# EAGLE design me433_hw2 (EAGLE 5.12)
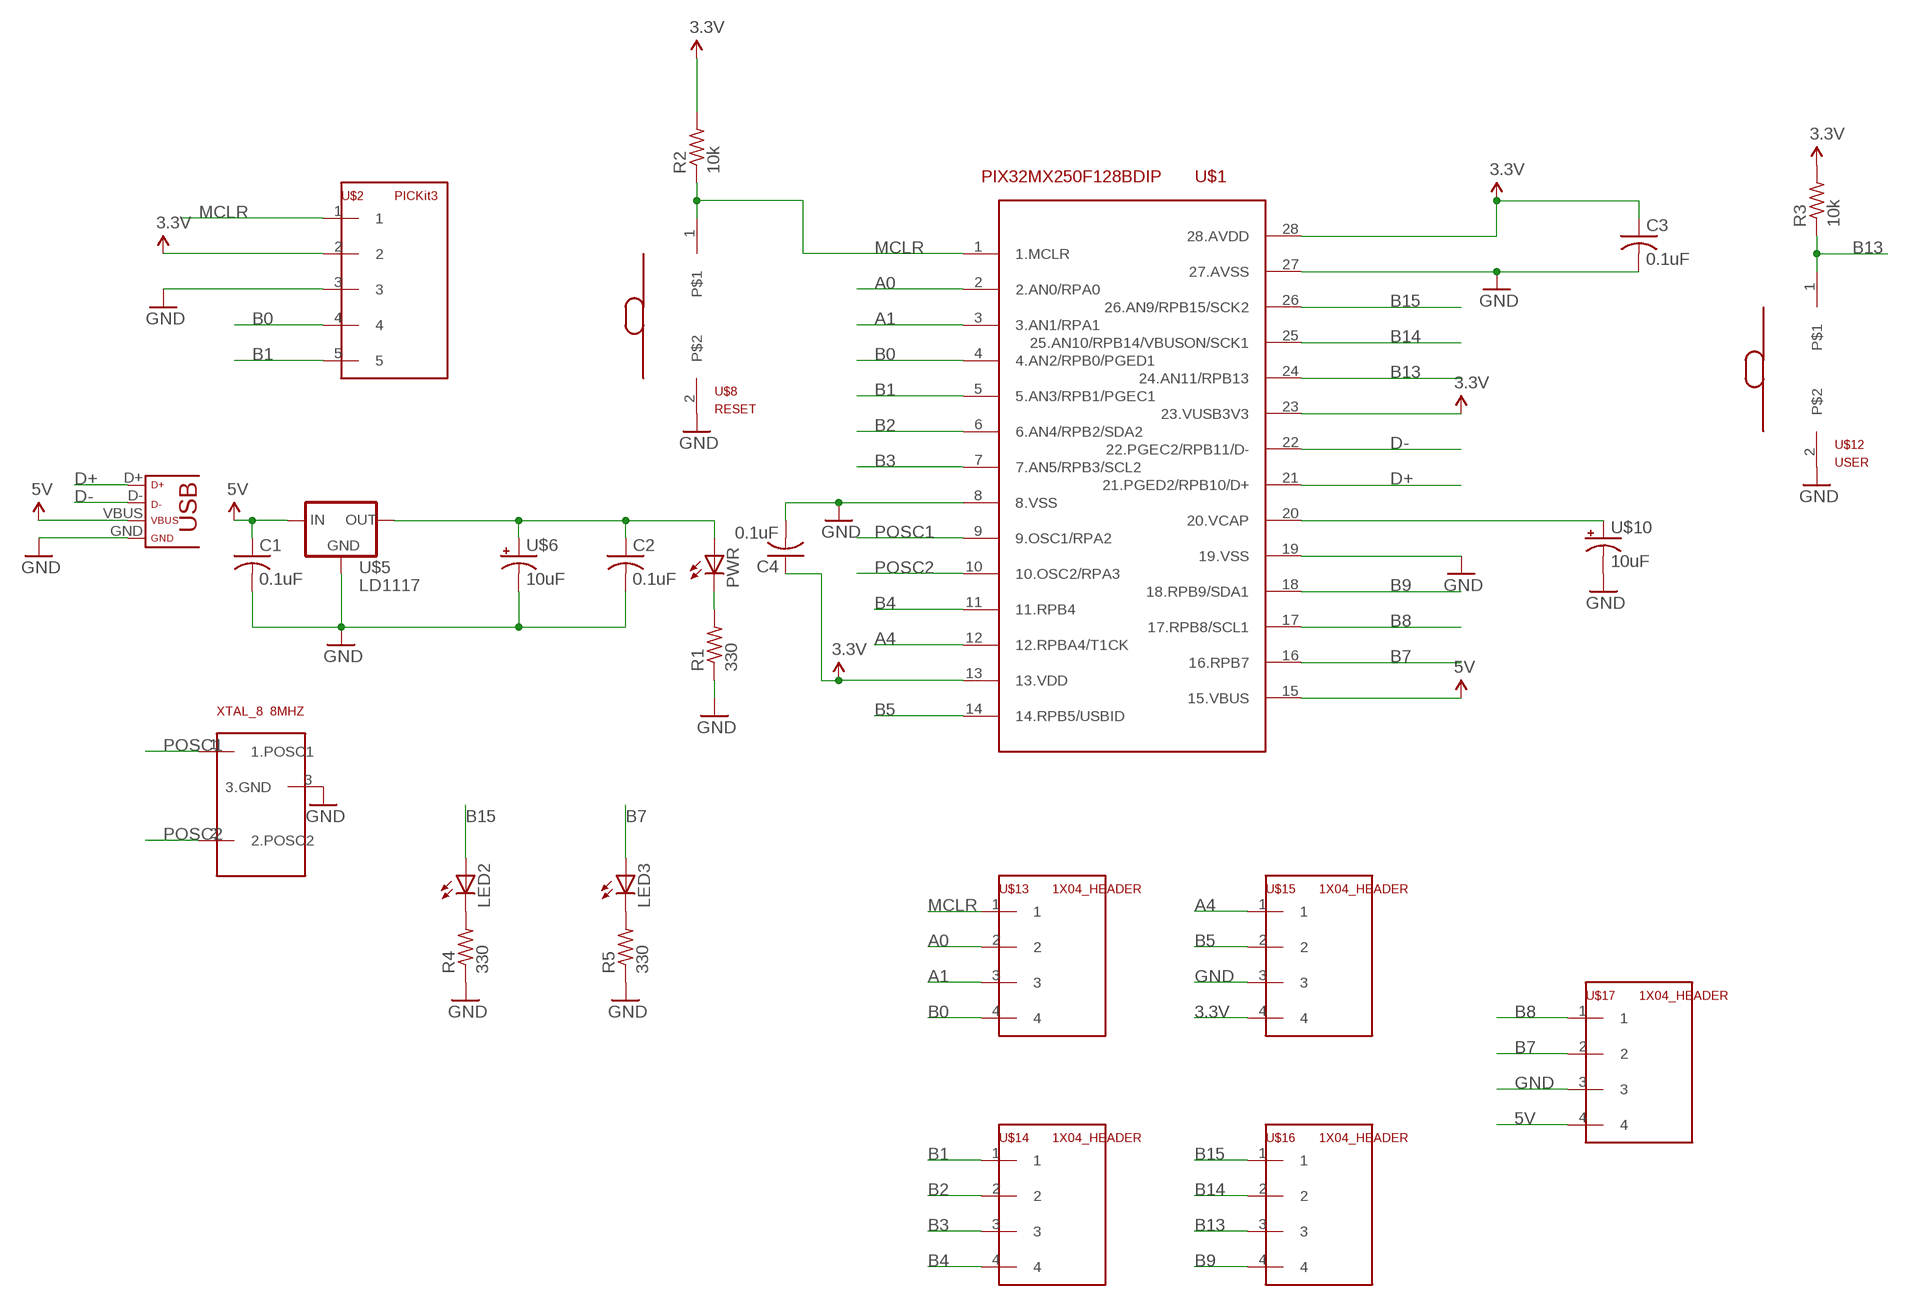
[diagram p0: schematic, sheet 1]

## Parts
8MHZ  XTAL_8  [UM4]
C1  0.1uF  C-US025-024X044  [C025-024X044]
C2  0.1uF  C-US025-024X044  [C025-024X044]
C3  0.1uF  C-US025-024X044  [C025-024X044]
C4  0.1uF  C-US025-024X044  [C025-024X044]
LED2  LED3MM  [LED3MM]
LED3  LED3MM  [LED3MM]
PWR  LED3MM  [LED3MM]
R1  330  R-US_0207/7  [0207/7]
R2  10k  R-US_0207/7  [0207/7]
R3  10k  R-US_0207/7  [0207/7]
R4  330  R-US_0207/7  [0207/7]
R5  330  R-US_0207/7  [0207/7]
U$1  PIX32MX250F128BDIP  PIC_HEADER  [PIC_HEADER]
U$2  PICKit3  1X05_HEADER  [1X05]
U$4  USB  [USB-MINIB]
U$5  LD1117  [TO220]
U$6  10uF  CAP_POL  [CAP_POL_D]
U$8  RESET  PUSH_SWITCH  [PUSH_SWITCH]
U$10  10uF  CAP_POL  [CAP_POL_D]
U$12  USER  PUSH_SWITCH  [PUSH_SWITCH]
U$13  1X04_HEADER  [1X04]
U$14  1X04_HEADER  [1X04]
U$15  1X04_HEADER  [1X04]
U$16  1X04_HEADER  [1X04]
U$17  1X04_HEADER  [1X04]

## Nets
3.3V: C3.1 C4.1 R2.2 R3.2 U$1.13(13.VDD) U$1.23(23.VUSB3V3) U$1.28(28.AVDD) U$2.2 U$15.4
5V: C1.1 U$1.15(15.VBUS) U$4.VBUS U$5.3(IN) U$17.4
A0: U$1.2(2.AN0/RPA0) U$13.2
A1: U$1.3(3.AN1/RPA1) U$13.3
A4: U$1.12(12.RPBA4/T1CK) U$15.1
B0: U$1.4(4.AN2/RPB0/PGED1) U$2.4 U$13.4
B1: U$1.5(5.AN3/RPB1/PGEC1) U$2.5 U$14.1
B2: U$1.6(6.AN4/RPB2/SDA2) U$14.2
B3: U$1.7(7.AN5/RPB3/SCL2) U$14.3
B4: U$1.11(11.RPB4) U$14.4
B5: U$1.14(14.RPB5/USBID) U$15.2
B7: LED3.A U$1.16(16.RPB7) U$17.2
B8: U$1.17(17.RPB8/SCL1) U$17.1
B9: U$1.18(18.RPB9/SDA1) U$16.4
B13: R3.1 U$1.24(24.AN11/RPB13) U$12.1 U$16.3
B14: U$1.25(25.AN10/RPB14/VBUSON/SCK1) U$16.2
B15: LED2.A U$1.26(26.AN9/RPB15/SCK2) U$16.1
D+: U$1.21(21.PGED2/RPB10/D+) U$4.D+
D-: U$1.22(22.PGEC2/RPB11/D-) U$4.D-
GND: 8MHZ.3(3.GND) C1.2 C2.2 C3.2 C4.2 R1.1 R4.1 R5.1 U$1.8(8.VSS) U$1.19(19.VSS) U$1.27(27.AVSS) U$2.3 U$4.GND U$5.1(GND) U$6.2(-) U$8.2 U$10.2(-) U$12.2 U$15.3 U$17.3
MCLR: R2.1 U$1.1(1.MCLR) U$2.1 U$8.1 U$13.1
N$1: PWR.K(C) R1.2
N$2: C2.1 PWR.A U$5.2(OUT) U$6.1(+)
N$3: LED2.K(C) R4.2
N$4: LED3.K(C) R5.2
N$16: U$1.20(20.VCAP) U$10.1(+)
POSC1: 8MHZ.1(1.POSC1) U$1.9(9.OSC1/RPA2)
POSC2: 8MHZ.2(2.POSC2) U$1.10(10.OSC2/RPA3)

## Library data of the parts
8MHZ = me422_hw2:XTAL_8
C1-C4 = me422_hw2:C-US: CAPACITOR, American symbol
LED2 LED3 PWR = me422_hw2:LED: LED OSRAM: - CHIPLED LG R971, LG N971, LY N971, LG Q971, LY Q971, LO R971, LY R971 LH N974, LH R974 LS Q976, LO Q976, LY Q976 LO Q996 - Hyper CHIPLED LW Q18S LB Q993, LB Q99A, LB R99A - SideLED LS A670, LO A670, LY A670, LG A670, LP A670 LB A673, LV A673, LT A673, LW A673 LH A674 LY A675 LS A676, LA A676, LO A676, LY A676, LW A676 LS A679, LY A679, LG A679 - Hyper Micro SIDELED® LS Y876, LA Y876, LO Y876, LY Y876 LT Y87S - SmartLED LW L88C, LW L88S LB L89C, LB L89S, LG L890 LS L89K, LO L89K, LY L89K LS L896, LA L896, LO L896, LY L896 - TOPLED LS T670, LO T670, LY T670, LG T670, LP T670 LSG T670, LSP T670, LSY T670, LOP T670, LYG T670 LG T671, LOG T671, LSG T671 LB T673, LV T673, LT T673, LW T673 LH T674 LS T676, LA T676, LO T676, LY T676, LB T676, LH T676, LSB T676, LW T676 LB T67C, LV T67C, LT T67C, LS T67K, LO T67K, LY T67K, LW E67C LS E67B, LA E67B, LO E67B, LY E67B, LB E67C, LV E67C, LT E67C LW T67C LS T679, LY T679, LG T679 LS T770, LO T770, LY T770, LG T770, LP T770 LB T773, LV T773, LT T773, LW T773 LH T774 LS E675, LA E675, LY E675, LS T675 LS T776, LA T776, LO T776, LY T776, LB T776 LHGB T686 LT T68C, LB T68C - Hyper Mini TOPLED® LB M676 - Mini TOPLED Santana® LG M470 LS M47K, LO M47K, LY M47K Source: http://www.osram.convergy.de LUXEON: - LUMILED® LXK2-PW12-R00, LXK2-PW12-S00, LXK2-PW14-U00, LXK2-PW14-V00 LXK2-PM12-R00, LXK2-PM12-S00, LXK2-PM14-U00 LXK2-PE12-Q00, LXK2-PE12-R00, LXK2-PE12-S00, LXK2-PE14-T00, LXK2-PE14-U00 LXK2-PB12-K00, LXK2-PB12-L00, LXK2-PB12-M00, LXK2-PB14-N00, LXK2-PB14-P00, LXK2-PB14-Q00 LXK2-PR12-L00, LXK2-PR12-M00, LXK2-PR14-Q00, LXK2-PR14-R00 LXK2-PD12-Q00, LXK2-PD12-R00, LXK2-PD12-S00 LXK2-PH12-R00, LXK2-PH12-S00 LXK2-PL12-P00, LXK2-PL12-Q00, LXK2-PL12-R00 Source: www.luxeon.com KINGBRIGHT: KA-3528ASYC Source: www.kingbright.com
R1-R5 = me422_hw2:R-US_: RESISTOR, American symbol
U$1 = me422_hw2:PIC_HEADER
U$2 = ME433:1X05_HEADER
U$4 = me422_hw2:USB
U$5 = me422_hw2:LD1117
U$6 U$10 = me422_hw2:CAP_POL
U$8 U$12 = me422_hw2:PUSH_SWITCH
U$13-U$17 = me422_hw2:1X04_HEADER

## Board
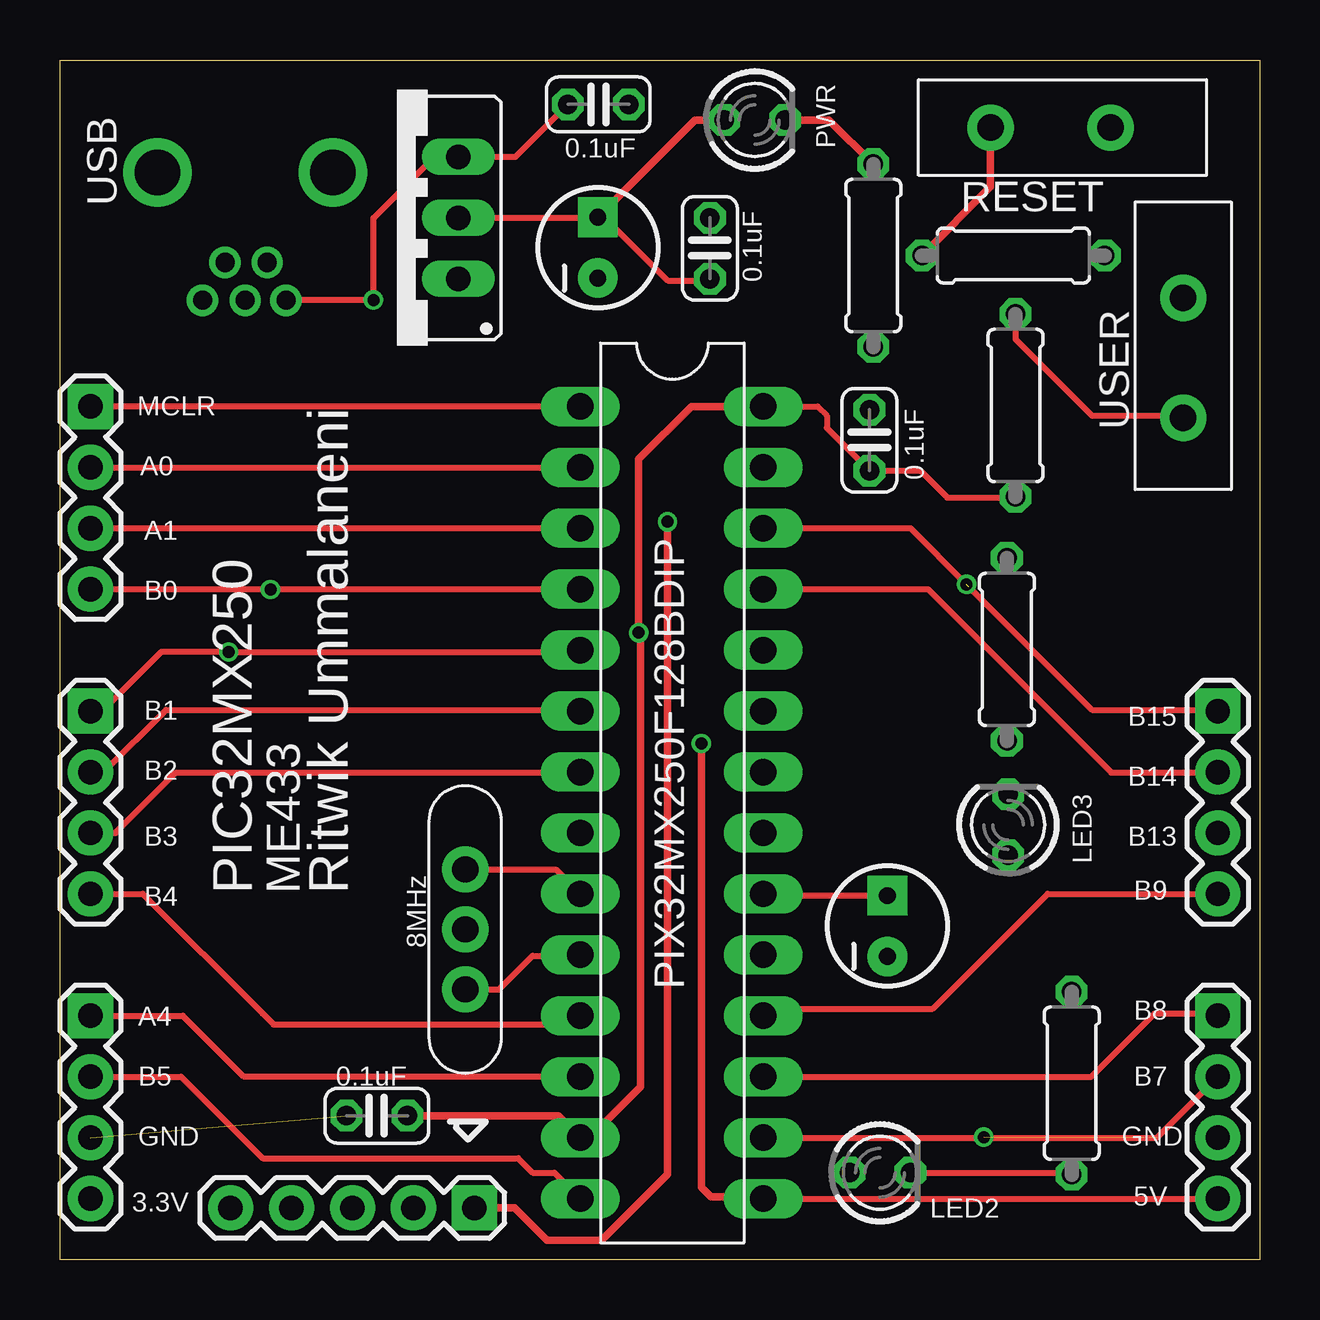
[diagram p1: board, top side]
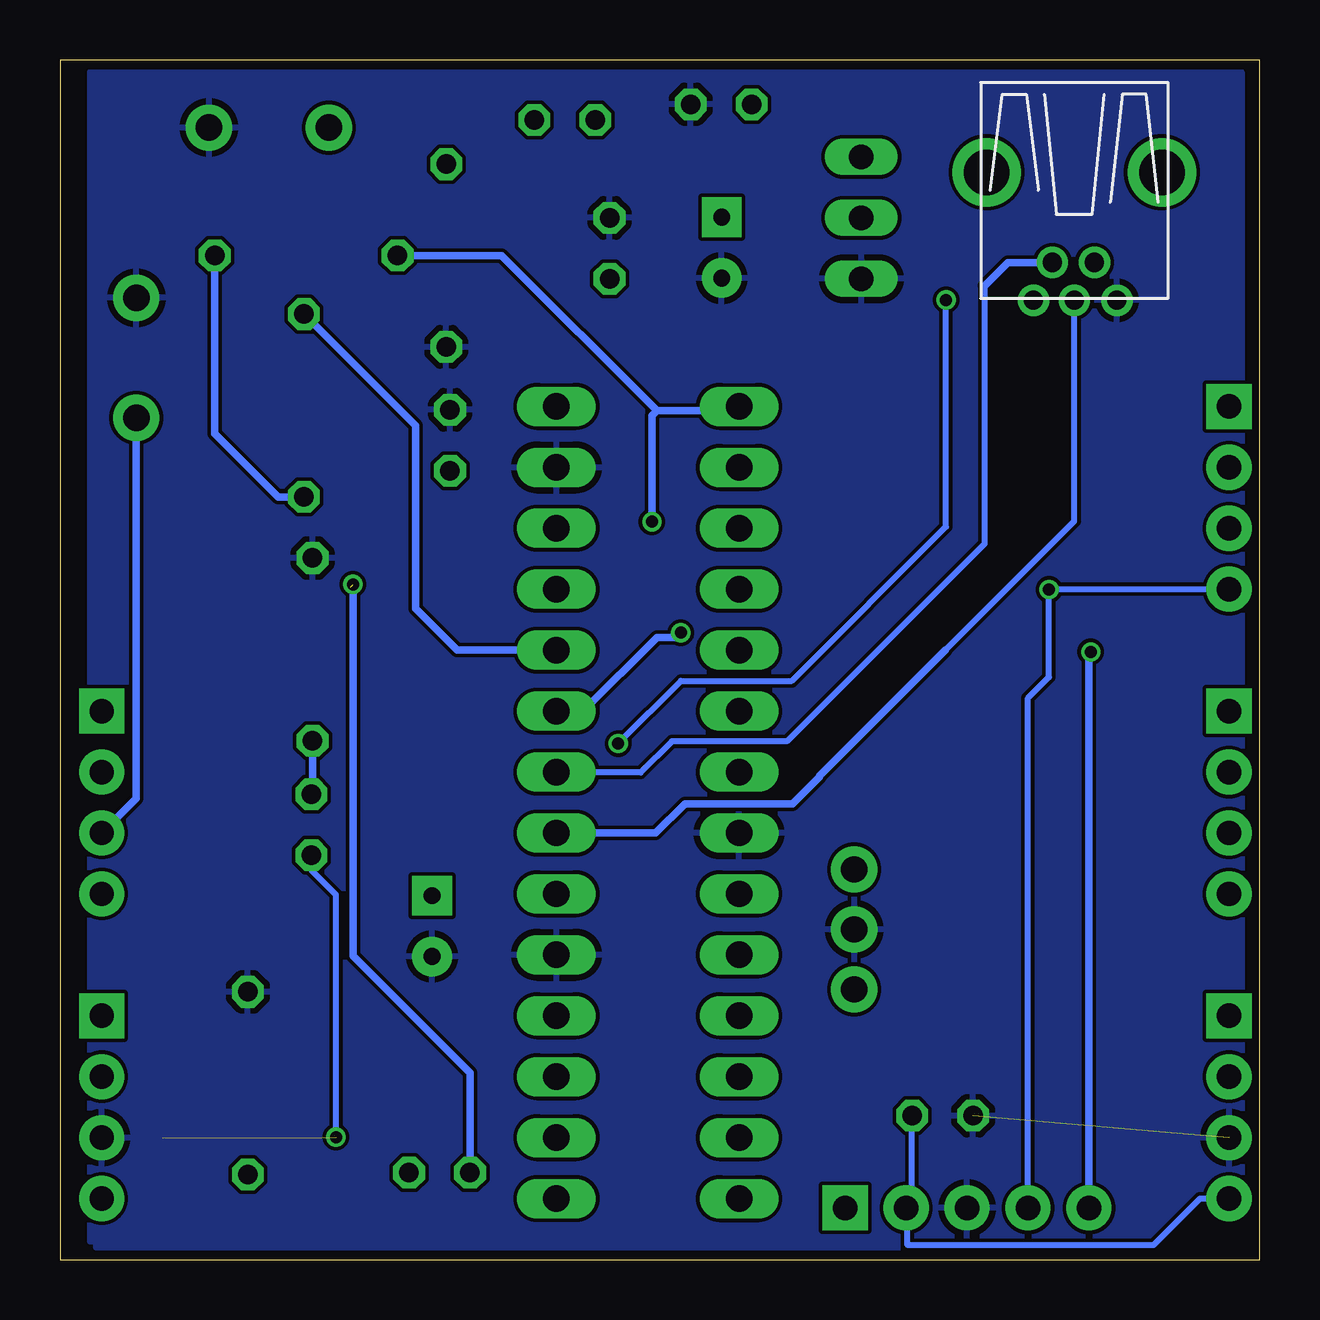
[diagram p2: board, bottom side, seen from below]

Size 50 x 50 mm. Coordinates in mm from the lower left corner, seen from the top.
Outline: 50,50 50,0 0,0 0,50 50,50
Copper layers (1*16): Top 0.035mm / dielectric 1.5mm / Bottom 0.035mm
Design rules "SeedStudio_hw2": minimum track width 6mil, minimum drill 12mil, track to track 6mil, track to pad 6mil, pad to pad 6mil, via to via 6mil, smd to smd 0mil, copper to edge 10mil, drill to drill 10mil, minimum pad ring 10mil, minimum via ring 6mil, stop-mask expansion 2mil, vias tented up to drill 100mil, thermal gap 10mil

### Footprints (pad centres in the part's own frame; a part is rotated, then mirrored left to right if it is on the bottom)
UM4 = drill 1.1 pad 1.93 round: 1 -5,-7.5; 2 0,-7.5; 3 -2.5,-7.5
C025-024X044 = drill 0.813 octagon: 1 -1.27,0; 2 1.27,0
LED3MM = drill 0.813 octagon: A -1.27,0; K 1.27,0
0207/7 = drill 0.813 octagon: 1 -3.81,0; 2 3.81,0
PIC_HEADER = drill 1.1 long: 1 -53.34,22.86; 2 -53.34,20.32; 3 -53.34,17.78; 4 -53.34,15.24; 5 -53.34,12.7; 6 -53.34,10.16; 7 -53.34,7.62; 8 -53.34,5.08; 9 -53.34,2.54; 10 -53.34,0; 11 -53.34,-2.54; 12 -53.34,-5.08; 13 -53.34,-7.62; 14 -53.34,-10.16; 15 -45.72,-10.16; 16 -45.72,-7.62; 17 -45.72,-5.08; 18 -45.72,-2.54; 19 -45.72,0; 20 -45.72,2.54; 21 -45.72,5.08; 22 -45.72,7.62; 23 -45.72,10.16; 24 -45.72,12.7; 25 -45.72,15.24; 26 -45.72,17.78; 27 -45.72,20.32; 28 -45.72,22.86
1X05 = drill 1.016 pad 1.88 square: 1 0,0 | drill 1.016 pad 1.88 round: 2 2.54,0; 3 5.08,0; 4 7.62,0; 5 10.16,0
USB-MINIB = drill 0.8 round: D+ 4.064,0; D- 2.489,0.914; GND 4.064,-1.778; ID 2.489,-0.838; VBUS 4.064,1.702 | drill 1.9 round: P$6 -1.27,-3.65; P$7 -1.27,3.65
TO220 = drill 1.016 long: 1 -2.54,0; 2 0,0; 3 2.54,0
CAP_POL_D = drill 0.7 pad 1.651 square: 1 1.27,0 | drill 0.7 pad 1.651 round: 2 -1.27,0
PUSH_SWITCH = drill 1.1 pad 1.93 round: 1 -5,0; 2 0,0
1X04 = drill 1.016 pad 1.88 square: 1 0,0 | drill 1.016 pad 1.88 round: 2 2.54,0; 3 5.08,0; 4 7.62,0

### Placement (x,y rotation side)
8MHZ  24.39,11.26 270 top
C1  22.44,48.15 0 top
C2  27.09,42.15 90 top
C3  33.74,34.15 90 top
C4  13.21,6 180 top
LED2  34.18,3.62 0 top
LED3  39.52,18.12 90 top
PWR  28.96,47.5 0 top
R1  33.9,41.85 90 top
R2  39.74,41.85 0 top
R3  39.83,35.6 270 top
R4  42.17,7.35 270 top
R5  39.47,25.43 270 top
U$1  75.03,12.7 0 top
U$2  17.27,2.15 180 top
U$4  7.72,44.05 270 top
U$5  16.6,43.42 90 top
U$6  22.42,42.18 90 top
U$8  43.79,47.18 0 top
U$10  34.49,13.9 90 top
U$12  46.82,40.09 90 top
U$13  1.27,35.56 270 top
U$14  1.27,22.86 270 top
U$15  1.27,10.16 270 top
U$16  48.26,22.86 270 top
U$17  48.26,10.16 270 top

### Tracks (layer width: path | path; a pad name or v marks a point on that pad's centre or on a via)
3.3V  (via drill 0.5)
  Top 0.254: U$1.28 31.57,35.56 31.96,35.17 31.96,34.66 C3.1 35.86,32.88 36.98,31.76 39.8,31.76 R3.2
  Top 0.305: C4.1 20.77,6 U$1.13 22.08,5.08 24.2,7.2 24.2,26.05 v24.12,26.13 24.12,33.37 26.31,35.56 U$1.28
  Bottom 0.254: C4.1 14.48,2.4 U$2.2 14.67,2.09 14.67,0.6 4.42,0.6 2.48,2.54 U$15.4
  Bottom 0.305: U$1.23 28.19,22.86 25.12,25.93 24.32,25.93 v24.12,26.13 | R3.2 40.91,31.79 43.55,34.42 R2.2
5V  (via drill 0.5)
  Top 0.254: U$4.VBUS 9.44,40 v13.06,40 13.06,43.42 15.61,45.96 U$5.3 18.98,45.96 C1.1 | U$1.15 U$17.4
  Top 0.305: v26.73,21.51 26.73,3.02 27.14,2.61 29.24,2.61 U$1.15
  Bottom 0.254: v13.06,40 13.06,30.55 19.5,24.12 24.12,24.12 v26.73,21.51
A0
  Top 0.254: U$13.2 U$1.2
A1
  Top 0.254: U$13.3 U$1.3
A4
  Top 0.254: U$15.1 5.12,10.16 7.64,7.64 21.67,7.64 U$1.12
B0  (via drill 0.5)
  Top 0.254: U$13.4 U$1.4
  Bottom 0.254: U$2.4 9.65,23.4 8.78,24.27 v8.78,27.93 | v8.78,27.93 v8.78,27.94 | U$13.4 8.76,27.94 v8.78,27.93
B1  (via drill 0.5)
  Top 0.254: U$14.1 1.75,22.86 4.22,25.33 v7.04,25.33 21.62,25.33 U$1.5
  Bottom 0.305: U$2.5 7.11,25.25 v7.04,25.33
B2
  Top 0.254: U$14.2 1.83,20.32 4.42,22.91 21.64,22.91 U$1.6
B3
  Top 0.254: U$14.3 2.3,17.78 4.82,20.3 21.67,20.3 U$1.7
B4
  Top 0.254: U$14.4 3.45,15.24 8.44,10.25 8.45,10.25 8.9,9.8 21.33,9.8 U$1.11 21.6,10.25
B5
  Top 0.254: U$15.2 5.04,7.62 8.44,4.22 19.09,4.22 19.7,3.62 20.61,3.62 U$1.14
B7  (via drill 0.5)  (1 unrouted)
  Top 0.254: U$17.2 45.72,5.08 U$1.16
  Bottom 0.254: LED3.A 39.52,16.22 38.5,15.2 v38.5,5.1 38.5,5.08
B8
  Top 0.254: U$1.17 43,7.62 45.63,10.25 48.17,10.25 U$17.1
B9
  Top 0.254: U$16.4 41.17,15.24 36.38,10.45 29.6,10.45 U$1.18
B13
  Top 0.254: R3.1 39.83,38.36 43.01,35.17 46.73,35.17 U$12.1
  Bottom 0.305: U$12.1 46.82,19.22 U$16.3 | U$1.24 33.44,25.4 35.17,27.14 35.17,34.76 R3.1
B14
  Top 0.254: U$1.25 36.18,27.94 43.82,20.3 48.24,20.3 U$16.2
B15  (via drill 0.5)  (1 unrouted)
  Top 0.254: U$1.26 35.45,30.48 v37.79,28.14 43.01,22.91 48.21,22.91 U$16.1
  Bottom 0.305: LED2.A 32.91,7.79 37.79,12.66 37.79,27.94 37.89,28.04
D+
  Bottom 0.254: U$4.D+ 7.72,30.78 13.1,25.4
  Bottom 0.305: U$1.21 25.17,17.78 23.95,19 19.48,19 18.35,20.12 18.35,20.15 13.1,25.4
D-
  Bottom 0.254: 11.46,40.6 11.46,29.84 19.7,21.6 24.5,21.6 25.8,20.3 29.29,20.3 U$1.22
  Bottom 0.305: U$4.D- 10.5,41.56 11.46,40.6 | U$1.22 29.29,20.3
GND  (1 unrouted)
  pour Bottom: 0.75,49 0.75,0.5 48.5,0.5 48.5,0.75 48.75,0.75 48.75,49.5 0.75,49.5
MCLR  (via drill 0.5)
  Top 0.254: U$1.1 U$13.1
  Top 0.305: U$8.1 38.79,44.71 R2.1 | U$2.1 18.95,2.15 20.3,0.8 22.58,0.8 25.32,3.55 v25.32,30.75 v25.33,30.75
  Bottom 0.305: R2.1 31.6,41.85 25.12,35.38 | U$1.1 21.87,35.38 25.12,35.38 | 25.12,35.38 25.33,35.17 v25.33,30.75 | U$2.1 17.29,2.13
N$1
  Top 0.305: PWR.K 32.06,47.5 R1.2
N$2
  Top 0.254: U$5.2 22.39,43.42 U$6.1 22.68,43.45 25.33,40.8 27.01,40.8 C2.1
  Top 0.305: PWR.A 26.47,47.5 U$6.1
N$3
  Top 0.254: LED2.K 42.09,3.62 R4.2
N$4
  Bottom 0.305: R5.2 39.47,19.44 LED3.K
N$16
  Top 0.254: U$10.1 29.38,15.17 U$1.20
POSC1
  Top 0.254: 8MHZ.1 20.67,16.26 U$1.9
POSC2
  Top 0.254: 8MHZ.2 18.3,11.26 19.7,12.66 21.65,12.66 U$1.10

### Text on the board
tPlace: PWR | 0.1uF | 0.1uF | MCLR | A0 | 0.1uF | A1 | B0 | B1 | B15 | B2 | B14 | B3 | B13 | LED3 | B4 | PIC32MX250 | ME433 | Ritwik Ummalaneni | B9 | 8MHz | A4 | B8 | 0.1uF | B5 | B7 | GND | GND | 3.3V | LED2 | 5V